# Altium schematic sheet MCU.SchDoc
size A3
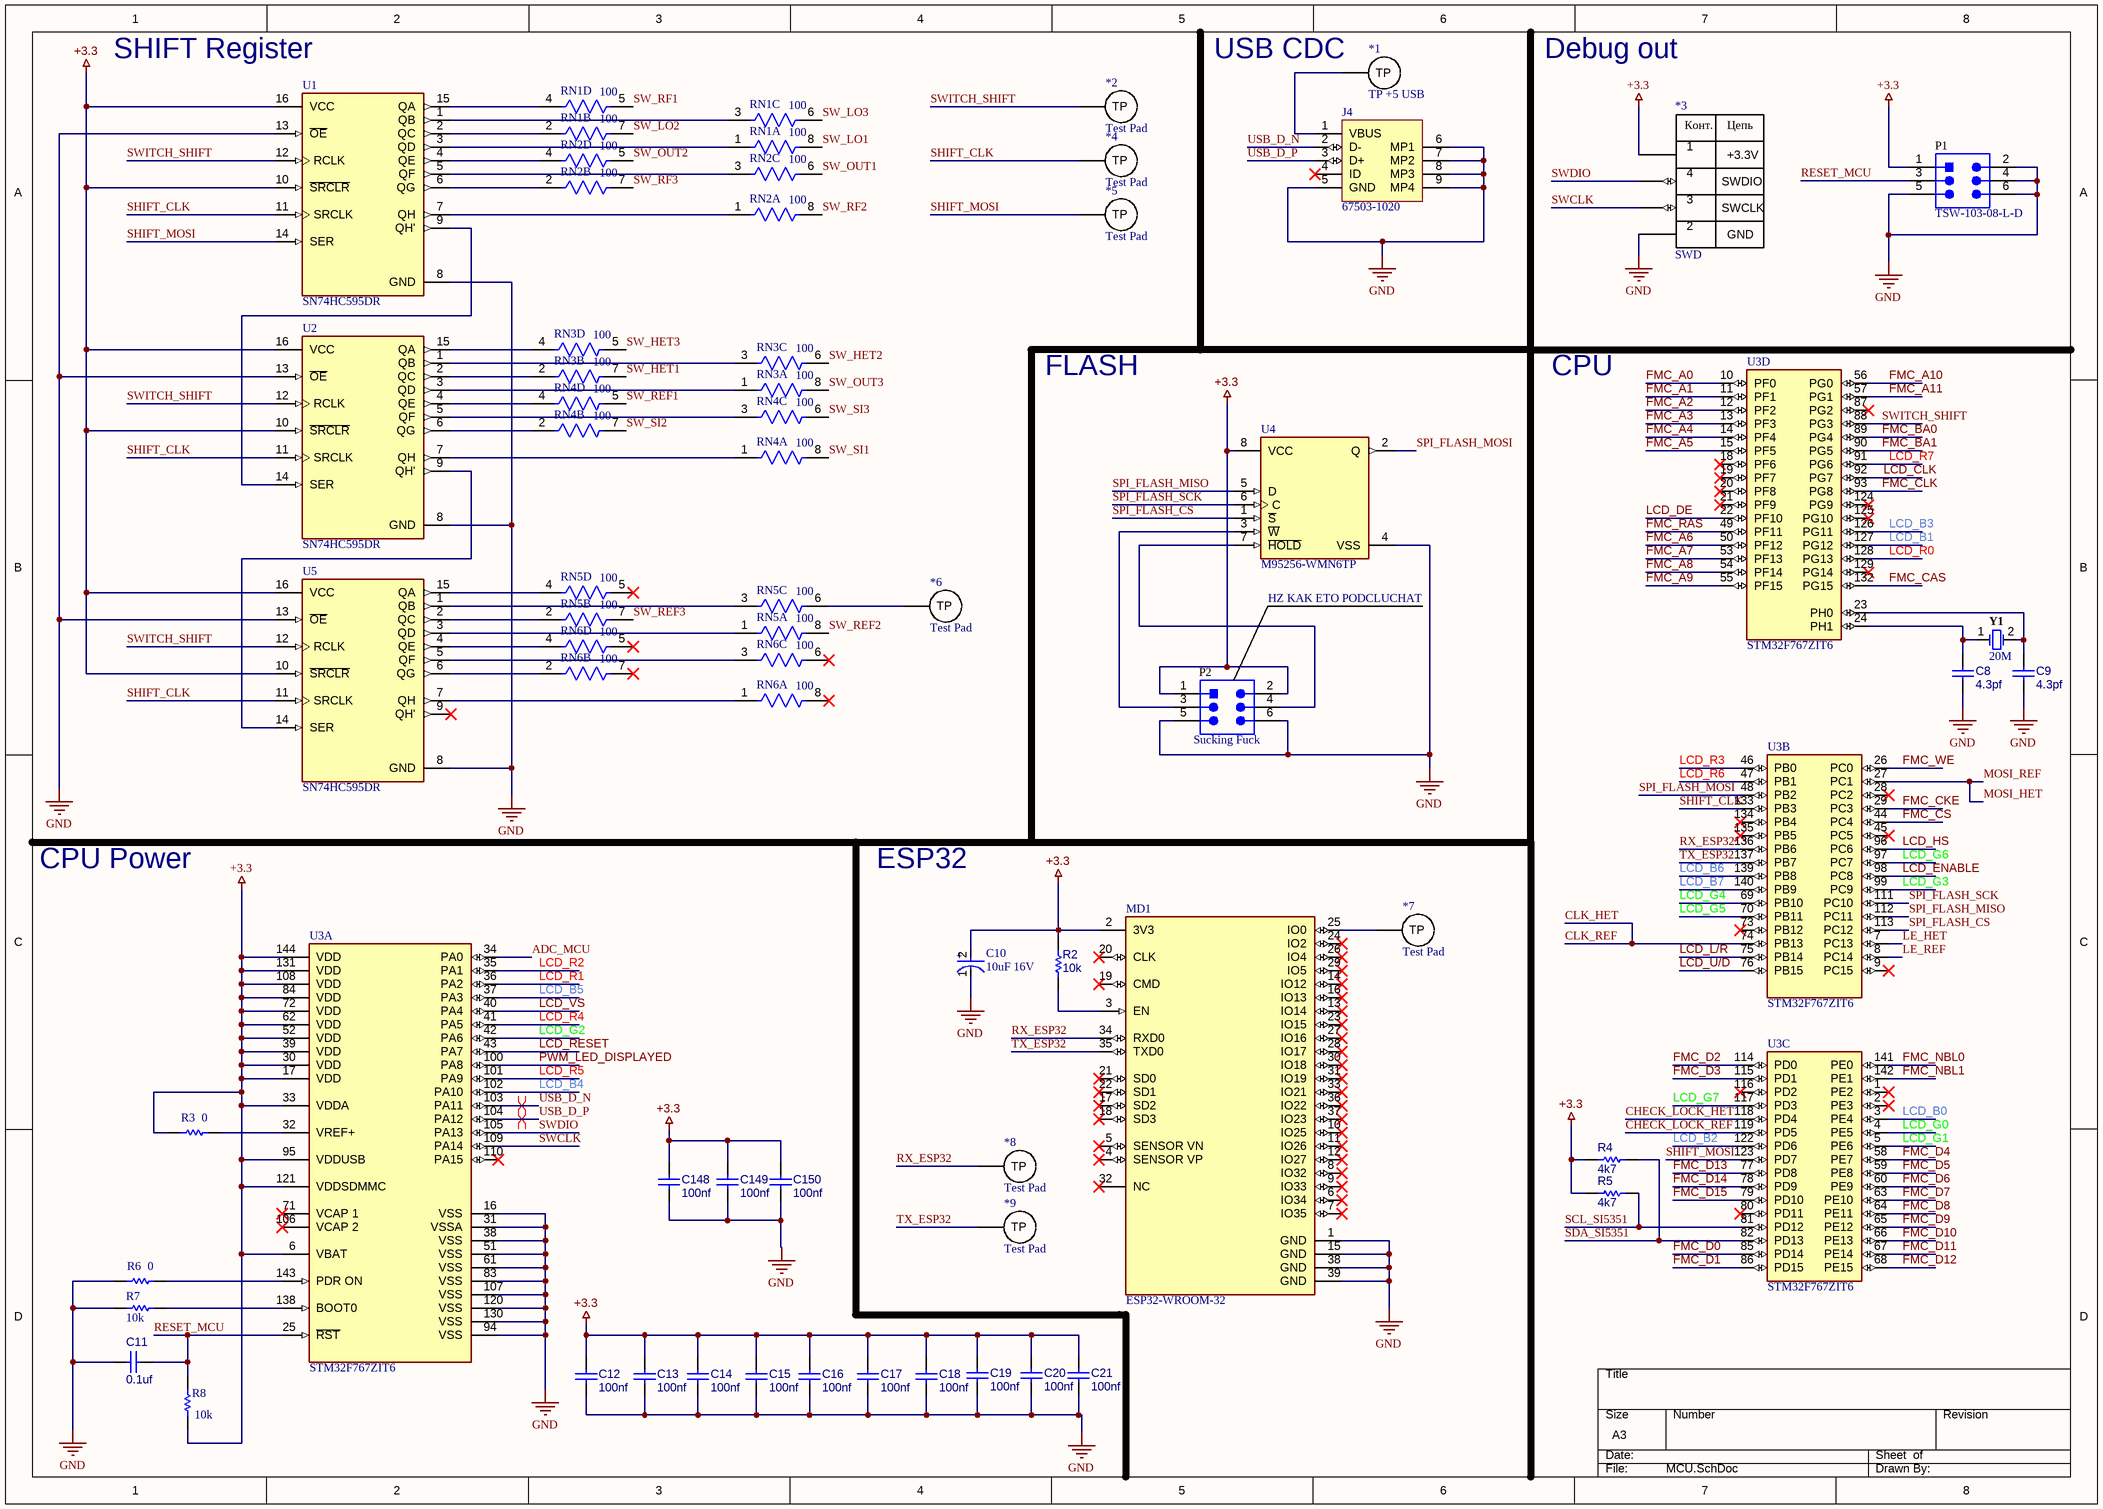
[diagram p0: MCU.SchDoc]

## Parts
*1  TP +5 USB  [Test Pad]
*2  Test Pad  [Test Pad]
*3  SWD  [PCBComponent_1]
*4  Test Pad  [Test Pad]
*5  Test Pad  [Test Pad]
*6  Test Pad  [Test Pad]
*7  Test Pad  [Test Pad]
*8  Test Pad  [Test Pad]
*9  Test Pad  [Test Pad]
C8  4.3pf  [CAPC2013X70X45NL10T25]
C9  4.3pf  [CAPC2013X70X45NL10T25]
C10  10uF 16V  [FP-TAJA-MFG]
C11  0.1uf  [CAPC2013X70X45NL10T25]
C12  100nf  [CAPC2013X70X45NL10T25]
C13  100nf  [CAPC2013X70X45NL10T25]
C14  100nf  [CAPC2013X70X45NL10T25]
C15  100nf  [CAPC2013X70X45NL10T25]
C16  100nf  [CAPC2013X70X45NL10T25]
C17  100nf  [CAPC2013X70X45NL10T25]
C18  100nf  [CAPC2013X70X45NL10T25]
C19  100nf  [CAPC2013X70X45NL10T25]
C20  100nf  [CAPC2013X70X45NL10T25]
C21  100nf  [CAPC2013X70X45NL10T25]
C148  100nf  [CAPC2013X70X45NL10T25]
C149  100nf  [CAPC2013X70X45NL10T25]
C150  100nf  [CAPC2013X70X45NL10T25]
J4  67503-1020  [MOLX-67503-1020_V]
MD1  ESP32-WROOM-32  [FP-ESP32-WROOM-32-MFG]
P1  TSW-103-08-L-D  [SMTC-TSW-103-08-L-D_V]
P2  Sucking Fuck  [SMTC-TSW-103-08-L-D_V]
R2  10k  [RESC2013X60X35ML10T20]
R3  0  [RESC2013X60X35ML10T20]
R4  4k7  [RESC2013X60X35ML10T20]
R5  4k7  [RESC2013X60X35ML10T20]
R6  0  [RESC2013X60X35ML10T20]
R7  10k  [RESC2013X60X35ML10T20]
R8  10k  [RESC2013X60X35ML10T20]
RN1  100  [FP-742C083-MFG]  (parts A,B,C,D of 4)
RN2  100  [FP-742C083-MFG]  (parts A,B,C,D of 4)
RN3  100  [FP-742C083-MFG]  (parts A,B,C,D of 4)
RN4  100  [FP-742C083-MFG]  (parts A,B,C,D of 4)
RN5  100  [FP-742C083-MFG]  (parts A,B,C,D of 4)
RN6  100  [FP-742C083-MFG]  (parts A,B,C,D of 4)
U1  SN74HC595DR  [FP-D0016A-MFG]
U2  SN74HC595DR  [FP-D0016A-MFG]
U3  STM32F767ZIT6  [FP-LQFP144-1A-MFG]  (parts A,B,C,D of 4)
U4  M95256-WMN6TP  [FP-SO8N-SO-A-MFG]
U5  SN74HC595DR  [FP-D0016A-MFG]
Y1  20M  [FOX-FOXSLF-2_V]

## Nets
+3.3: *3.1(+3.3V) C10.2(A) C12.2 C13.2 C14.2 C15.2 C16.2 C17.2 C18.2 C19.2 C20.2 C21.2 C148.2 C149.2 C150.2 MD1.2(3V3) P1.1 P2.1 P2.2 R2.2 R3.2 R4.2 R5.2 R8.1 U1.10(~{SRCLR}) U1.16(VCC) U2.10(~{SRCLR}) U2.16(VCC) U3.6(VBAT) U3.17(VDD) U3.30(VDD) U3.33(VDDA) U3.39(VDD) U3.52(VDD) U3.62(VDD) U3.72(VDD) U3.84(VDD) U3.95(VDDUSB) U3.108(VDD) U3.121(VDDSDMMC) U3.131(VDD) U3.144(VDD) U4.8(VCC) U5.10(~{SRCLR}) U5.16(VCC)
GND: *3.2(GND) C8.2 C9.2 C10.1(C) C11.2 C12.1 C13.1 C14.1 C15.1 C16.1 C17.1 C18.1 C19.1 C20.1 C21.1 C148.1 C149.1 C150.1 J4.5(GND) J4.6(MP1) J4.7(MP2) J4.8(MP3) J4.9(MP4) MD1.1(GND) MD1.15(GND) MD1.38(GND) MD1.39(GND) P1.2 P1.4 P1.5 P1.6 P2.5 P2.6 R6.2 R7.2 U1.8(GND) U1.13(~{OE}) U2.8(GND) U2.13(~{OE}) U3.16(VSS) U3.31(VSSA) U3.38(VSS) U3.51(VSS) U3.61(VSS) U3.83(VSS) U3.94(VSS) U3.107(VSS) U3.120(VSS) U3.130(VSS) U4.4(VSS) U5.8(GND) U5.13(~{OE})
ADC_MCU: U3.34(PA0)
CHECK_LOCK_HET: U3.118(PD4)
CHECK_LOCK_REF: U3.119(PD5)
CLK_HET: U3.74(PB13)  [also labelled CLK_REF]
FMC_A0: U3.10(PF0)
FMC_A1: U3.11(PF1)
FMC_A2: U3.12(PF2)
FMC_A3: U3.13(PF3)
FMC_A4: U3.14(PF4)
FMC_A5: U3.15(PF5)
FMC_A6: U3.50(PF12)
FMC_A7: U3.53(PF13)
FMC_A8: U3.54(PF14)
FMC_A9: U3.55(PF15)
FMC_A10: U3.56(PG0)
FMC_A11: U3.57(PG1)
FMC_BA0: U3.89(PG4)
FMC_BA1: U3.90(PG5)
FMC_CAS: U3.132(PG15)
FMC_CKE: U3.29(PC3)
FMC_CLK: U3.93(PG8)
FMC_CS: U3.44(PC4)
FMC_D0: U3.85(PD14)
FMC_D1: U3.86(PD15)
FMC_D2: U3.114(PD0)
FMC_D3: U3.115(PD1)
FMC_D4: U3.58(PE7)
FMC_D5: U3.59(PE8)
FMC_D6: U3.60(PE9)
FMC_D7: U3.63(PE10)
FMC_D8: U3.64(PE11)
FMC_D9: U3.65(PE12)
FMC_D10: U3.66(PE13)
FMC_D11: U3.67(PE14)
FMC_D12: U3.68(PE15)
FMC_D13: U3.77(PD8)
FMC_D14: U3.78(PD9)
FMC_D15: U3.79(PD10)
FMC_NBL0: U3.141(PE0)
FMC_NBL1: U3.142(PE1)
FMC_RAS: U3.49(PF11)
FMC_WE: U3.26(PC0)
LCD_B0: U3.3(PE4)
LCD_B1: U3.127(PG12)
LCD_B2: U3.122(PD6)
LCD_B3: U3.126(PG11)
LCD_B4: U3.102(PA10)
LCD_B5: U3.37(PA3)
LCD_B6: U3.139(PB8)
LCD_B7: U3.140(PB9)
LCD_CLK: U3.92(PG7)
LCD_DE: U3.22(PF10)
LCD_ENABLE: U3.98(PC8)
LCD_G0: U3.4(PE5)
LCD_G1: U3.5(PE6)
LCD_G2: U3.42(PA6)
LCD_G3: U3.99(PC9)
LCD_G4: U3.69(PB10)
LCD_G5: U3.70(PB11)
LCD_G6: U3.97(PC7)
LCD_G7: U3.117(PD3)
LCD_HS: U3.96(PC6)
LCD_L/R: U3.75(PB14)
LCD_R0: U3.128(PG13)
LCD_R1: U3.36(PA2)
LCD_R2: U3.35(PA1)
LCD_R3: U3.46(PB0)
LCD_R4: U3.41(PA5)
LCD_R5: U3.101(PA9)
LCD_R6: U3.47(PB1)
LCD_R7: U3.91(PG6)
LCD_RESET: U3.43(PA7)
LCD_U/D: U3.76(PB15)
LCD_VS: U3.40(PA4)
LE_HET: U3.7(PC13)
LE_REF: U3.8(PC14)
MOSI_HET: U3.27(PC1)  [also labelled MOSI_REF]
PWM_LED_DISPLAYED: U3.100(PA8)
RESET_MCU: C11.1 P1.3 R8.2 U3.25(~{RST})
RX_ESP32: *8.1(TP) MD1.34(RXD0) U3.136(PB6)
SCL_SI5351: R5.1 U3.81(PD12)
SDA_SI5351: R4.1 U3.82(PD13)
SHIFT_CLK: *4.1(TP) U1.11(SRCLK) U2.11(SRCLK) U3.133(PB3) U5.11(SRCLK)
SHIFT_MOSI: *5.1(TP) U1.14(SER) U3.123(PD7)
SPI_FLASH_CS: U3.113(PC12) U4.1(~{S})
SPI_FLASH_MISO: U3.112(PC11) U4.5(D)
SPI_FLASH_MOSI: U3.48(PB2) U4.2(Q)
SPI_FLASH_SCK: U3.111(PC10) U4.6(C)
SW_HET1: RN3.7
SW_HET2: RN3.6
SW_HET3: RN3.5
SW_LO1: RN1.8
SW_LO2: RN1.7
SW_LO3: RN1.6
SW_OUT1: RN2.6
SW_OUT2: RN2.5
SW_OUT3: RN3.8
SW_REF1: RN4.5
SW_REF2: RN5.8
SW_REF3: RN5.7
SW_RF1: RN1.5
SW_RF2: RN2.8
SW_RF3: RN2.7
SW_SI1: RN4.8
SW_SI2: RN4.7
SW_SI3: RN4.6
SWCLK: *3.3(SWCLK) U3.109(PA14)
SWDIO: *3.4(SWDIO) U3.105(PA13)
SWITCH_SHIFT: *2.1(TP) U1.12(RCLK) U2.12(RCLK) U3.88(PG3) U5.12(RCLK)
TX_ESP32: *9.1(TP) MD1.35(TXD0) U3.137(PB7)
USB_D_N: J4.2(D-) U3.103(PA11)
USB_D_P: J4.3(D+) U3.104(PA12)
Net*1_1: *1.1(TP) J4.1(VBUS)
Net*6_1: *6.1(TP) RN5.6
Net*7_1: *7.1(TP) MD1.25(IO0)
NetC8_1: C8.1 U3.24(PH1) Y1.1
NetC9_1: C9.1 U3.23(PH0) Y1.2
NetMD1_3: MD1.3(EN) R2.1
NetP2_3: P2.3 U4.3(~{W})
NetP2_4: P2.4 U4.7(~{HOLD})
NetR3_1: R3.1 U3.32(VREF+)
NetR6_1: R6.1 U3.143(PDR_ON)
NetR7_1: R7.1 U3.138(BOOT0)
NetRN1_1: RN1.1 U1.3(QD)
NetRN1_2: RN1.2 U1.2(QC)
NetRN1_3: RN1.3 U1.1(QB)
NetRN1_4: RN1.4 U1.15(QA)
NetRN2_1: RN2.1 U1.7(QH)
NetRN2_2: RN2.2 U1.6(QG)
NetRN2_3: RN2.3 U1.5(QF)
NetRN2_4: RN2.4 U1.4(QE)
NetRN3_1: RN3.1 U2.3(QD)
NetRN3_2: RN3.2 U2.2(QC)
NetRN3_3: RN3.3 U2.1(QB)
NetRN3_4: RN3.4 U2.15(QA)
NetRN4_1: RN4.1 U2.7(QH)
NetRN4_2: RN4.2 U2.6(QG)
NetRN4_3: RN4.3 U2.5(QF)
NetRN4_4: RN4.4 U2.4(QE)
NetRN5_1: RN5.1 U5.3(QD)
NetRN5_2: RN5.2 U5.2(QC)
NetRN5_3: RN5.3 U5.1(QB)
NetRN5_4: RN5.4 U5.15(QA)
NetRN6_1: RN6.1 U5.7(QH)
NetRN6_2: RN6.2 U5.6(QG)
NetRN6_3: RN6.3 U5.5(QF)
NetRN6_4: RN6.4 U5.4(QE)
NetU1_9: U1.9(QH') U2.14(SER)
NetU2_9: U2.9(QH') U5.14(SER)

Not connected (* = marked no-connect by the designer): J4 4(ID)*; MD1 4(SENSOR_VP)* 5(SENSOR_VN)* 6(IO34)* 7(IO35)* 8(IO32)* 9(IO33)* 10(IO25)* 11(IO26)* 12(IO27)* 13(IO14)* 14(IO12)* 16(IO13)* 17(SD2)* 18(SD3)* 19(CMD)* 20(CLK)* 21(SD0)* 22(SD1)* 23(IO15)* 24(IO2)* 26(IO4)* 27(IO16)* 28(IO17)* 29(IO5)* 30(IO18)* 31(IO19)* 32(NC)* 33(IO21)* 36(IO22)* 37(IO23)*; RN5 5*; RN6 5* 6* 7* 8*; U3 1(PE2)* 2(PE3)* 9(PC15)* 18(PF6)* 19(PF7)* 20(PF8)* 21(PF9)* 28(PC2)* 45(PC5)* 71(VCAP_1)* 73(PB12)* 80(PD11)* 87(PG2)* 106(VCAP_2)* 110(PA15)* 116(PD2)* 124(PG9)* 125(PG10)* 129(PG14)* 134(PB4)* 135(PB5)*; U5 9(QH')*

## Layout directives
differential pair: USB_D_N, USB_D_P

## Notes on the sheet
- (near U1) SHIFT Register
- USB CDC
- Debug out
- FLASH
- CPU
- (near U4) HZ KAK ETO PODCLUCHAT
- CPU Power
- ESP32
- (in symbol CMP-04424-000155-1) +
- (in symbol SWD) Конт.; Цепь

## Library data of the parts
*1 = Test Pad
C8 C9 C11-C21 C148-C150 = CMP-2007-00957-1: Part Number: GRM216R61E105KA12D; Manufacturer: Murata
C10 = CMP-04424-000155-1: 3.3uF 25V  ±20% 3.7Ω 1206  SMD Tantalum Capacitor; Dissipation Factor: 6%; Leakage Current: 800nA; Polarity: Polar; ESR (Equivalent Series Resistance): 3.7R; Height - Seated (Max): 0.071inch; Mount: Surface Mount; Packaging: Tape and Reel; Case Code (Metric): 3216; RoHS Compliant: Yes; Tolerance: 20%; Voltage Rating (DC): 25V; Voltage Rating: 25V; Weight: 0.000571oz; Package Quantity: 2000; Series: TAJ; Height: 1.8mm; Case/Package: 1206; Capacitance: 3.3uF; Number of Pins: 2; Max Operating Temperature: 125°C; Construction: Flat; Width: 1.6mm; Lead Free: Lead Free; Depth: 1.6mm; Termination: SMD/SMT; Min Operating Temperature: -55°C; Case Code (Imperial): 1206; Length: 3.2mm; Radiation Hardening: No; Features: General Purpose
J4 = CMP-0411-00002-1: USB, MINI, SMD, RA KME04-USBMU03A01; Manufacturer: Molex; ComponentLink1URL: http://www.molex.com/; PartNumber: 67503-1020; Mounting Technology: Surface Mount; ComponentLink1Description: Manufacturer URL; Terminal Pitch: 0.8 mm; DatasheetVersion: Rev F, 06/2009; ComponentLink2Description: Datasheet; PackageDescription: Mini USB Connector, SMT, Righer Angle; ComponentLink2URL: http://www.molex.com/pdm_docs/sd/675031020_sd.pdf; PackageReference: 67503-1020
MD1 = CMP-194065-000008-1: RX TXRX MOD WIFI SURFACE MOUNT; Frequency: 2.5GHz; Sensitivity: -98dBm; Operating Supply Voltage: 3.6V; Data Rate: 150Mbps; Weight: 0.088185oz; Package Quantity: 550; Min Operating Temperature: -40°C; Mount: Surface Mount; Max Operating Temperature: 85°C; Packaging: Cut Tape; Case/Package: SMD/SMT
P1 P2 = CMP-1024-00336-5: Male Header, Pitch 2.54 mm, 2 x 3 Position, Height 8.38 mm, Tail Length 5.08 mm, -55 to 125 degC, RoHS, Bulk; Manufacturer: Samtec; DatasheetVersion: 04/2012; ComponentLink3URL: http://suddendocs.samtec.com/prints/tsw-xxx-xx-x-x-xx-xxx-footprint.pdf; PackageReference: TSW-103-08-L-D; Mounting Technology: Through Hole; Min Operating Temperature: -55 degC; ComponentLink2Description: Datasheet; Lead Pitch: 2.54 mm; ComponentLink1Description: Manufacturer URL; Mount: Through Hole; ComponentLink1URL: http://www.samtec.com/; ComponentLink3Description: Package Specification; Max Operating Temperature: 125 degC; PackageDescription: Male Header, Pitch 2.54 mm, 2 x 3 Position, Height 8.38 mm, Tail Length 5.08 mm; ComponentLink2URL: https://datasheet.ciiva.com/25618/0900766b81154476-25618436.pdf; RoHSCompliant: true
R2-R8 = CMP-2100-03671-1: Chip Resistor, 1 KOhm, +/- 1%, 125 mW, -55 to 155 degC, 0805 (2012 Metric), RoHS, Tape and Reel; Manufacturer: Yageo; Temperature Coefficient: 100ppm/degreesC; Voltage Rating (DC): 150V; Max Power Dissipation: 125mW; Resistance: 1KOhm; Number of Pins: 2; Number of Terminations: 2; Datasheet URL: http://www.yageo.com/NewPortal/yageodocoutput?fileName=/pdf/R-Chip/PYu-RC_Group_51_RoHS_L_5.pdf; Length: 0.079inch; Package Description: 2-Pin Surface Mounted Device, Body 2 x 1.25 mm; Depth: 1.25mm; Height: 0.024inch; Military Standard: Not; Case/Package: 0805; Package Reference: 0805; RoHSCompliant: true; Lead Free: LeadFree; Packaging: TapeandReel; Package Quantity: 1; Datasheet Version: Rev. 5, 10/2016; Tolerance: 1%; Min Operating Temperature: -55degC; Voltage Rating: 150V; Composition: ThickFilm; Case Code (Imperial): 0805; Power Rating: 125mW; Width: 0.049inch; Case Code (Metric): 2012; Manufacturer URL: http://www.yageo.com/; Max Operating Temperature: 155degC; REACH SVHC: Unknown; Termination: SMD/SMT
RN1-RN6 = CMP-06828-000007-1: RES ARRAY 4 RES 22 OHM 1206; Power Dissipation: 63mW; Tolerance: 5%; Resistance: 22R; Number of Resistors: 4; Voltage Rating: 50V; Circuit Type: Isolated; Power Rating: 250mW; Temperature Coefficient: 200ppm/°C; Depth: 1.6mm; Number of Terminals: 8; Contact Plating: Tin; Height: 0.6mm; Terminal Pitch: 0.8mm; Mount: Surface Mount; Min Operating Temperature: -55°C; Military Standard: Not; Power Per Element: 63mW; Max Operating Temperature: 125°C; Length: 3.2mm; Number of Elements: 4; Package Quantity: 5000; Number of Pins: 8; Radiation Hardening: No; Packaging: Tape and Reel; Termination: Concave; Lead Free: Lead Free; Case/Package: Molded
U1 U2 U5 = CMP-0780-00037-4: IC 8BIT SHIFT REG 3ST-OUT 16SOIC; Manufacturer: Texas Instruments; Max Supply Voltage: 6V; Nominal Supply Current: 80uA; Number Of Circuits: 1; Max Junction Temp: +150°C; Propagation Delay: 43ns; Frequency: 29MHz; Min Supply Voltage: 2V; Standoff Height: 0.1mm; Number Of Outputs: 9; Height: 1.75mm; Automotive: No; Device Class L1: Integrated Circuits (ICs); ComponentLink2Description: Datasheet; Ambient Temperature Range Low: -40°C; Ambient Temperature Range High: +85°C; Digikey Description: IC 8BIT SHIFT REG 3ST-OUT 16SOIC; ComponentLink2URL: http://www.ti.com/lit/ds/symlink/sn74hc595.pdf; Package: D0016A; Lead Free: Yes; Manufacturer Part Number: SN74HC595DR; Device Class L3: Shift Registers; Category: IC; Number Of Inputs: 1; Octopart: https://octopart.com/sn74hc595dr-texas+instruments-500634; Ipc Land Pattern Name: SOIC127P600X175-16; Device Class L2: Logic ICs; Temperature Range Low: -40°C; RoHS: TRUE; Temperature: -40°C to +85°C; Temperature Range High: +85°C; Mouser Description: Counter Shift Registers 8bit Shift
U3 = CMP-12105-000074-1: IC MCU 32BIT 2MB FLASH 144LQFP; Manufacturer: STMicroelectronics; Ram Size: 512KBytes; Number Of I/Os: 114; Core Architecture: ARM Cortex-M7; Memory Size: 2048KBytes; Standoff Height: 0.05mm; Number Of Adc Channels: 24; Max Supply Voltage: 3.6V; Number Of Pwm Channels: 4; Min Supply Voltage: 1.7V; Max Junction Temp: +105°C; Number Of Timers/Counters: 15; Number Of Usb Channels: 1; Interface: I2C,SPI,UART,USART,EBI/EMI,CAN,USB,LIN,IrDA,Ethernet,I2S; Frequency: 216MHz; Data Bus Width: 32bits; Number Of Spi Channels: 6; Number Of A/D Converters: 3; Octopart: https://octopart.com/stm32f767zit6-stmicroelectronics-70527068; Category: IC; Device Class L2: Embedded Processors and Controllers; Package: LQFP144-1A; RoHS: TRUE; Digikey Description: IC MCU 32BIT 2MB FLASH 144LQFP; ComponentLink2Description: Datasheet; Automotive: No; Mouser Description: ARM Microcontrollers - MCU High-performance and DSP with FPU, ARM Cortex-M7 MCU with 2 Mbytes Flash, 216 MHz CPU, Art Accelerator, L1 cache, SDRAM,; Ambient Temperature Range Low: -40°C; Ambient Temperature Range High: +85°C; Memory Type: FLASH; ComponentLink2URL: https://www.st.com/resource/en/datasheet/stm32f767zi.pdf; Number Of Uart Channels: 4; Temperature: -40°C to +85°C; Device Class L3: Microcontrollers; Device Class L1: Integrated Circuits (ICs); Temperature Range Low: -40°C; Temperature Range High: +85°C; Lead Free: Yes; Number Of I2C Channels: 4; Number Of Ethernet Channels: 1; Height: 1.6mm; Number Of Cores: 1; Manufacturer Part Number: STM32F767ZIT6; Ipc Land Pattern Name: QFP50P2200X2200X160-144
U4 = CMP-12142-000008-1: IC EEPROM 256K SPI 20MHZ 8SO; Manufacturer: STMicroelectronics; Memory Size: 256Kbits; Max Supply Voltage: 5.5V; Min Supply Voltage: 2.5V; Access Time: 60ns; Nominal Supply Current: 2-5mA; Standoff Height: 0.1mm; Package: SO8N-SO-A; Height: 1.75mm; Ipc Land Pattern Name: SOIC127P600X175-8; Lead Free: Yes; Device Class L3: EEPROM; Octopart: https://octopart.com/m95256-wmn6tp-stmicroelectronics-842801; Automotive: No; ComponentLink2Description: Datasheet; Frequency: 20MHz; Device Class L2: Memory; Temperature Range Low: -40°C; Temperature: -40°C to +85°C; Device Class L1: Integrated Circuits (ICs); Memory Type: EEPROM; Ambient Temperature Range High: +85°C; Digikey Description: IC EEPROM 256K SPI 20MHZ 8SO; ComponentLink2URL: https://www.st.com/resource/en/datasheet/m95256-w.pdf; Interface: SPI; Temperature Range High: +85°C; Manufacturer Part Number: M95256-WMN6TP; Mouser Description: EEPROM 2.5 V to 5.5V 256k; Ambient Temperature Range Low: -40°C; RoHS: TRUE; Category: IC
Y1 = CMP-1749-00004-1: Resistance Weld Thru-Hole Crystal, 12 MHz, +/-30 ppm, -20 to 70 degC, 2-Pin THD, RoHS, Bulk; Elements: 1; Rds On Max: 115 mohm; Typical Rise Time: 90 ns; Max Power Dissipation: 2.5 W; Case\Package: TO-251-3; Input Capacitance: 350 pF; REACH SVHC: No SVHC; Length: 6.6 mm; ComponentLink1URL: http://www.foxonline.com/; PackageDescription: 2-Pin Through Hole Device, Body 11.35 x 4.65 mm, Pitch 4.88 mm; Radiation Hardening: No; Package Quantity: 70; Packaging: Rail/Tube; ComponentLink1Description: Manufacturer URL; Min Operating Temperature: -55 degC; Max Operating Temperature: 150 degC; RoHSCompliant: true; PackageReference: FOXSLF-2; DatasheetVersion: Mar-15; Pins: 3; Height: 6.1 mm; Mount: Through Hole; ComponentLink2URL: http://www.foxonline.com/pdfs/hc49slf.pdf; ComponentLink2Description: Datasheet; Width: 2.3 mm